# Altium schematic sheet Cap.schdoc
size 297 x 209 mm; Symbol: Drawing-Symbol_A4; @Project Name: Odin; @Page Count: 10; @Update Date: 2026-01-23; @Create Date: 2026-01-23; @Schematic Name: Odin; @Page No: 10; @Page Name: Cap; Company: EasyEDA.com; Version: V1.0; Page Size: A4; @Create Time: 18:43:24; @Update Time: 13:43:37; Border: 1; Width: 1170; Height: 825; Region Start: 1; X Region Count: 6; Y Region Count: 4; Blade Width: 10; Title Block Position: 3; @Board Name: Odin_V1.0.0; Device: Drawing-Symbol_A4
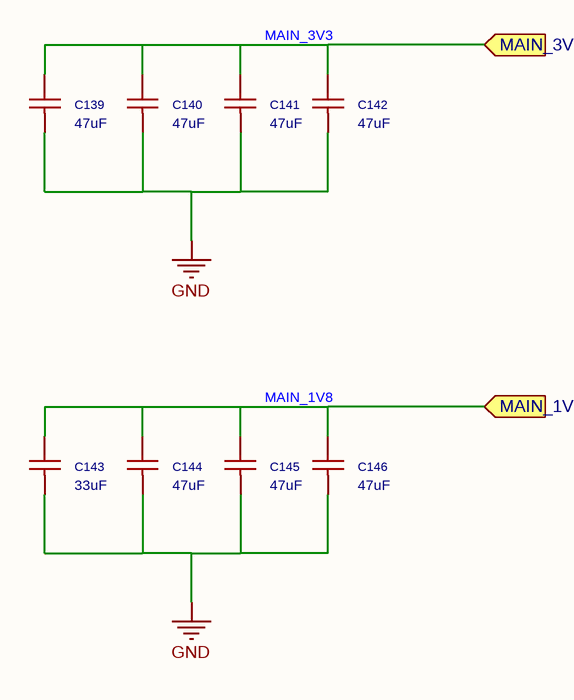
[diagram p0: Cap.schdoc]

## Parts
C139  47uF  [C0603]
C140  47uF  [C0603]
C141  47uF  [C0603]
C142  47uF  [C0603]
C143  33uF  [C0603]
C144  47uF  [C0603]
C145  47uF  [C0603]
C146  47uF  [C0603]

## Ports
MAIN_1V8 (in), MAIN_3V3 (in)

## Nets
GND: C139.1 C140.1 C141.1 C142.1 C143.1 C144.1 C145.1 C146.1
MAIN_1V8: C143.2 C144.2 C145.2 C146.2 ; port MAIN_1V8
MAIN_3V3: C139.2 C140.2 C141.2 C142.2 ; port MAIN_3V3

## Notes on the sheet
- Create at
- 2026-01-23
- Schematic
- Board
- Odin
- Odin_V1.0.0
- Update at
- Page
- Cap
- Drawn
- Reviewed
- Version
- V1.0
- Size
- A4
- Page  10  Total  10
- EasyEDA.com

## Library data of the parts
C139-C146 = CL10B223KB8NNNC: Capacitance:22nF Tolerance:±10% Tolerance:±10% Voltage Rating:50V Temperature Coefficient:X7R; Manufacturer: SAMSUNG(三星); AddInBom: yes; ModelId: 624118aa3cc7497086c383c2d72e0852; ModelName: C0603_L1.6-W0.8-H0.8; ModelTransform: 62.992,31.496,0,0,0,0,0,0,0; Tolerance: ±10%; Voltage Rating: 50V; Temperature Coefficient: X7R; Symbol: CL10B223KB8NNNC; Device: CL10B223KB8NNNC; Supplier: LCSC; Manufacturer Part: CL10B223KB8NNNC; JLCPCB Part Class: Basic Part; LCSC Part Name: 22nF ±10% 50V; Supplier Footprint: 0603; Datasheet: https://item.szlcsc.com/datasheet/CL10B223KB8NNNC/21834.html; ConvertToPcb: yes; FootprintName: C0603
  C139-C142 C144-C146: Value: 47uF
  C143: Value: 33uF